# Altium project VisualFarm_HW.PrjPcb
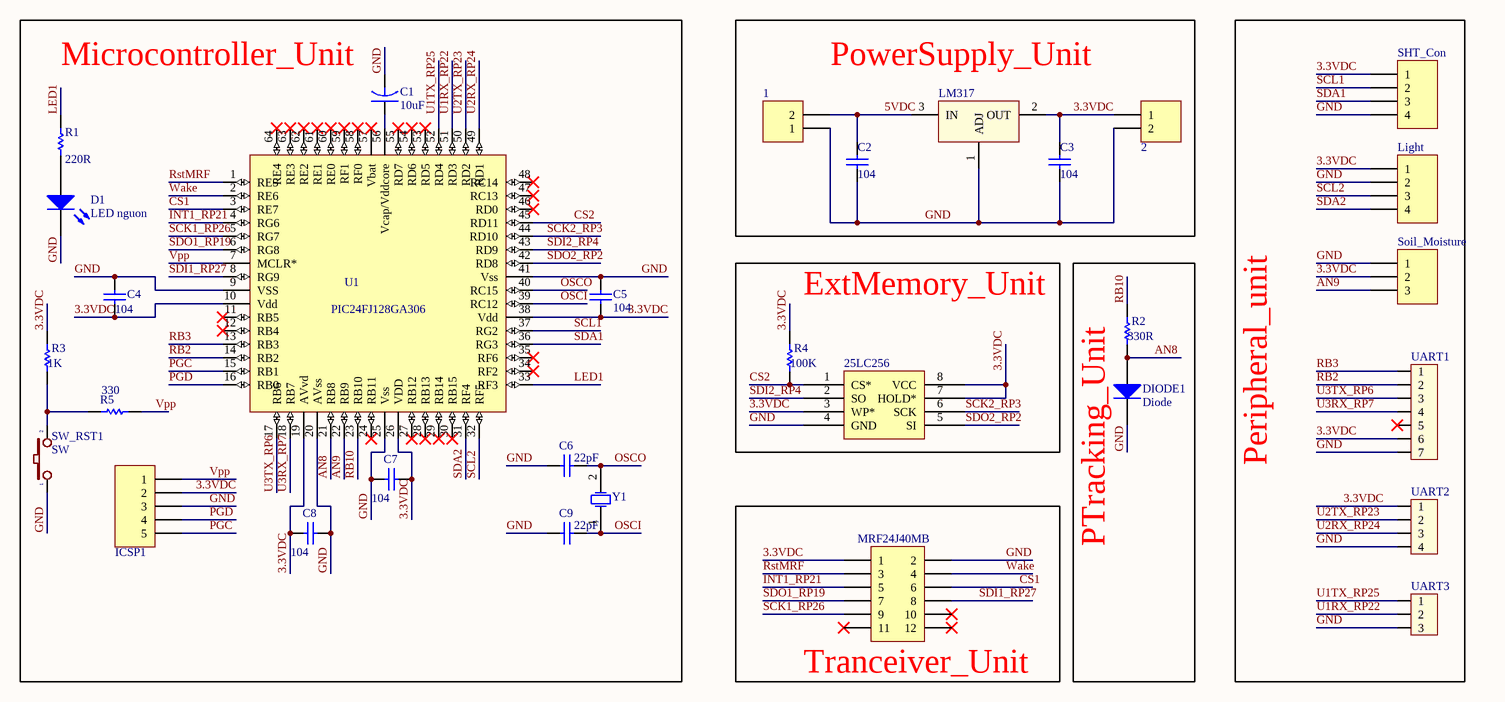
[diagram p0: VF_sch.SchDoc]
1 sheet, 31 parts. Net scope: global (net labels, ports and power ports of the same name join across sheets).
Board file: VF_pcb.PcbDoc

## Sheet VF_sch.SchDoc
size A3; PageSetup: Record=PageOptions|CenterHorizontal=True|CenterVertical=True|PrintScale=0.70|XCorrection=1.00|YCorrection=1.00|PrintKind=0|BorderSize=5000000|LeftOffset=0|BottomOffset=0|Orientation=2|PaperLength=1000|PaperWidth=1000|Scale=100|PaperSource=7|PrintQuality=-3|MediaType=1|DitherType=10|PrintScaleMode=1|PaperKind=Letter|PaperIndex=1

### Parts
1  Header 2  [HDR1X2]  (value not drawn)
2  3.3V DC  [HDR1X2]  (value not drawn)
3  25LC256  [DIP-8]
C1  10uF  [CP1/2.5_SM]
C2  value 104  [C0805]  (hidden comment: Cap)
C3  value 104  [C0805]  (hidden comment: Cap)
C4  value 104  [C0805]  (hidden comment: Cap)
C5  104  [RAD-0.3]
C6  value 22pF  [C0805]  (hidden comment: Cap)
C7  value 104  [C0805]  (hidden comment: Cap)
C8  value 104  [C0805]  (hidden comment: Cap)
C9  value 22pF  [C0805]  (hidden comment: Cap)
D1  LED nguon  [LED3mm]
DIODE1  Diode  [DZ0.5A]
ICSP1  ICSP  [CON5]  (value not drawn)
LM317  LM317  [SOT223-4N]  (value not drawn)
MRF1  MRF24J40MB  [HDR2X6]
P1  Light  [HDR1X4]
R1  value 220R  [C0805]  (hidden comment: Res1)
R2  value 330R  [C0805]  (hidden comment: Res1)
R3  value 1K  [C0805]  (hidden comment: Res1)
R4  value 100K  [C0805]  (hidden comment: Res Semi)
R5  value 330  [C0805]  (hidden comment: res)
SHT_CON1  SHT_Con  [CON4]
Soil_Moisture  Header 3  [HDR1X3]  (value not drawn)
SW_RST1  SW  [SW2]
U1  PIC24FJ128GA306  [MCHP-TQFP-PT64_M]
UART1  LORA_TRANCEIVER  [CON7]  (value not drawn)
UART2  UART2  [CON4]  (value not drawn)
UART3  (no value)  [CON3]
Y1  XTAL  [XT2]  (value not drawn)

### Blocks framed on the sheet
Microcontroller_Unit: C1 C4-C9 D1 ICSP1 R1 R3 R5 SW_RST1 U1 Y1
PowerSupply_Unit: 1 2 C2 C3 LM317
Peripheral_unit: P1 SHT_CON1 Soil_Moisture UART1-UART3
ExtMemory_Unit: 3 R4
PTracking_Unit: DIODE1 R2
Tranceiver_Unit: MRF1

### Nets
3.3VDC: 2.1 3.3(WP*) 3.7(HOLD*) 3.8(VCC) C3.2 C4.1 C5.1 C7.2 C8.1 ICSP1.2 LM317.2(OUT) MRF1.1 P1.1 R3.2 R4.2 SHT_CON1.1 Soil_Moisture.2 U1.10(Vdd) U1.19(AVvd) U1.26(VDD) U1.38(Vdd) UART1.6 UART2.1
5VDC: 1.2 C2.2 LM317.3(IN)
AN8: DIODE1.1(A) R2.1 U1.21(RB8)
AN9: Soil_Moisture.3 U1.22(RB9)
CS1: MRF1.6 U1.3(RE7)
CS2: 3.1(CS*) R4.1 U1.45(RD11)
GND: 1.1 2.2 3.4(GND) C1.2 C2.1 C3.1 C4.2 C5.2 C6.1 C7.1 C8.2 C9.1 D1.2(K) DIODE1.2(K) ICSP1.3 LM317.1(ADJ) MRF1.2 P1.2 SHT_CON1.4 Soil_Moisture.1 SW_RST1.1 U1.9(VSS) U1.20(AVss) U1.25(Vss) U1.41(Vss) UART1.7 UART2.4 UART3.3
INT1_RP21: MRF1.5 U1.4(RG6)
LED1: R1.2 U1.33(RF3)
OSCI: C9.2 U1.39(RC12) Y1.1(OSC1)
OSCO: C6.2 U1.40(RC15) Y1.2(OSC2)
PGC: ICSP1.5 U1.15(RB1)
PGD: ICSP1.4 U1.16(RB0)
RB2: U1.14(RB2) UART1.2
RB3: U1.13(RB3) UART1.1
RB10: R2.2 U1.23(RB10)
RstMRF: MRF1.3 U1.1(RE5)
SCK1_RP26: MRF1.9 U1.5(RG7)
SCK2_RP3: 3.6(SCK) U1.44(RD10)
SCL1: SHT_CON1.2 U1.37(RG2)
SCL2: P1.3 U1.32(RF5)
SDA1: SHT_CON1.3 U1.36(RG3)
SDA2: P1.4 U1.31(RF4)
SDI1_RP27: MRF1.8 U1.8(RG9)
SDI2_RP4: 3.2(SO) U1.43(RD9)
SDO1_RP19: MRF1.7 U1.6(RG8)
SDO2_RP2: 3.5(SI) U1.42(RD8)
U1RX_RP22: U1.51(RD3) UART3.2
U1TX_RP25: U1.52(RD4) UART3.1
U2RX_RP24: U1.49(RD1) UART2.3
U2TX_RP23: U1.50(RD2) UART2.2
U3RX_RP7: U1.18(RB7) UART1.4
U3TX_RP6: U1.17(RB6) UART1.3
Vpp: ICSP1.1 R5.2 U1.7(MCLR*)
Wake: MRF1.4 U1.2(RE6)
NetC1_1: C1.1 U1.56(Vcap/Vddcore)
NetD1_1: D1.1(A) R1.1
NetR3_1: R3.1 R5.1 SW_RST1.2

Not connected (* = marked no-connect by the designer): MRF1 10* 11* 12*; U1 11(RB5)* 12(RB4)* 24(RB11)* 27(RB12)* 28(RB13)* 29(RB14)* 30(RB15)* 34(RF2)* 35(RF6)* 46(RD0)* 47(RC13)* 48(RC14)* 53(RD5)* 54(RD6)* 55(RD7)* 57(Vbat)* 58(RF0)* 59(RF1)* 60(RE0)* 61(RE1)* 62(RE2)* 63(RE3)* 64(RE4)*; UART1 5*

### Notes on the sheet
- Title
- Size:
- Date:
- A3
- Number:
- Time:
- Revision:
- Sheet
- of
- File:

### Library data of the parts
1 2 = Header 2: Header, 2-Pin; LatestRevisionDate: 17-Jul-2002; LatestRevisionNote: Re-released for DXP Platform.; Publisher: Altium Limited
C1 = CAPACITOR
C2-C9 = Cap: Capacitor; Published: 8-Jun-2000; LatestRevisionDate: 17-Jul-2002; LatestRevisionNote: Re-released for DXP Platform.; PackageReference: RAD-0.3; Publisher: Altium Limited; PackageDescription: Radial Cap, Thru-Hole; 2 Leads; 0.3 in Pin Spacing
D1 = LED0: Typical INFRARED GaAs LED; Published: 8-Jun-2000; LatestRevisionDate: 08-Jul-2005; LatestRevisionNote: Mech Layer 1 removed.; PackageReference: LED-0; Publisher: Altium Limited; PackageDescription: LED; 2 Leads
DIODE1 = Diode: Default Diode; Published: 8-Jun-2000; LatestRevisionDate: 17-Jul-2002; LatestRevisionNote: Re-released for DXP Platform.; PackageVersion: Sep-1996; PackageReference: SMC; Publisher: Altium Limited; PackageDescription: DO-214-AB/SMC; 2 C-Bend Leads; Body 7.9 x 5.9 mm, inc. leads (LxW); Code_JEDEC: DO-214-AB
ICSP1 = Header 5: Header, 5-Pin; LatestRevisionDate: 17-Jul-2002; LatestRevisionNote: Re-released for DXP Platform.; Publisher: Altium Limited
LM317 = LM317: Adj Voltage +1.2 -> +37V; Value: LM317
MRF1 = Header 6X2: Header, 6-Pin, Dual row; LatestRevisionDate: 17-Jul-2002; LatestRevisionNote: Re-released for DXP Platform.; Publisher: Altium Limited
P1 SHT_CON1 = Header 4: Header, 4-Pin; LatestRevisionDate: 17-Jul-2002; LatestRevisionNote: Re-released for DXP Platform.; Publisher: Altium Limited
R1-R3 R5 = Res1: Resistor; Published: 8-Jun-2000; LatestRevisionDate: 17-Jul-2002; LatestRevisionNote: Re-released for DXP Platform.; PackageReference: AXIAL-0.3; Publisher: Altium Limited; PackageDescription: Axial Device, Thru-Hole; 2 Leads; 0.3 in Pin Spacing
R4 = Res Semi: Semiconductor Resistor; Published: 8-Jun-2000; LatestRevisionDate: 17-Jul-2002; LatestRevisionNote: Re-released for DXP Platform.; PackageReference: AXIAL-0.5; Publisher: Altium Limited; PackageDescription: Axial Device, Thru-Hole; 2 Leads; 0.5 in Pin Spacing
Soil_Moisture = Header 3: Header, 3-Pin; LatestRevisionDate: 17-Jul-2002; LatestRevisionNote: Re-released for DXP Platform.; Publisher: Altium Limited
SW_RST1 = SW2: Switch button 2 pin; Value: SW chip 2 pin
UART1 = Con7: Connector 7; Value: Connector 7
UART2 = Con4: Connector 4; Value: Connector 4
UART3 = Con3: Connector 3; Value: Connector 3
Y1 = XTAL: Crystal Oscillator; Published: 8-Jun-2000; LatestRevisionDate: 17-Jul-2002; LatestRevisionNote: Re-released for DXP Platform.; PackageReference: R38; Publisher: Altium Limited; PackageDescription: Crystal, Thru-Hole; 2 Leads; Body 3.1 x 8.2 mm (Dia.xH)